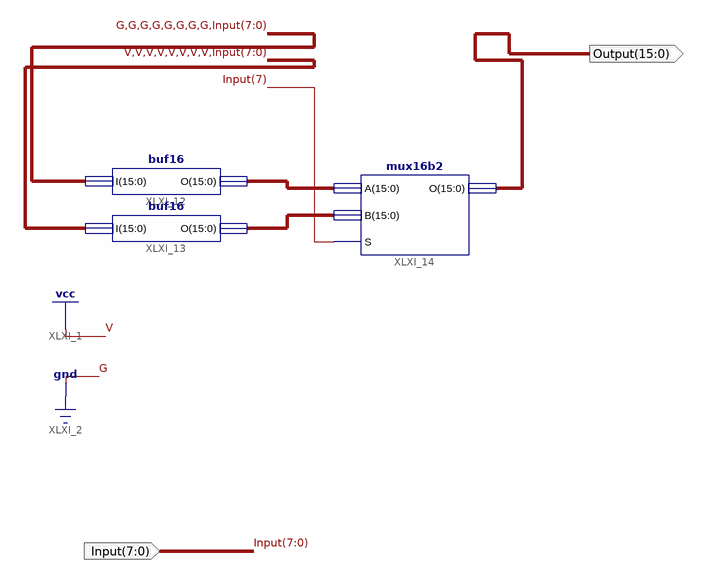
[diagram p0: schematic sheet 1]
// Xilinx ISE schematic Sign_Extended_8bits.sch (spartan3e) as structural Verilog: 3 symbols, 2 ports
module Sign_Extended_8bits (
  input  [7:0] Input,
  output [15:0] Output
);

  wire [15:0] XLXN_14, XLXN_15;

  buf16 XLXI_12 (.I({{8{1'b0}}, Input}), .O(XLXN_14));
  buf16 XLXI_13 (.I({{8{1'b1}}, Input}), .O(XLXN_15));
  mux16b2 XLXI_14 (.A(XLXN_14), .B(XLXN_15), .S(Input[7]), .O(Output));
endmodule
